# Altium schematic sheet SE_Diff.SchDoc
size A; SheetNumber: 13; SheetTotal: 14
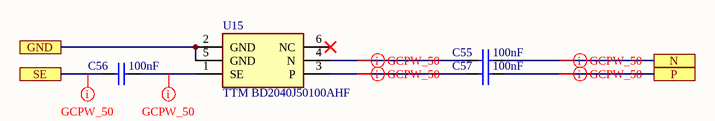
[diagram p0: SE_Diff.SchDoc]

## Parts
C55  100nF  [SMD-0402]
C56  100nF  [SMD-0402]
C57  100nF  [SMD-0402]
U15  TTM BD2040J50100AHF  [Anaren Balun BD2040J50100AHF]

## Ports
GND, N, P, SE

## Nets
GND: U15.2(GND) U15.5(GND) ; port GND
N: C55.1 ; port N
P: C57.1 ; port P
SE: C56.2 ; port SE
NetC55_2: C55.2 U15.4(N)
NetC56_1: C56.1 U15.1(SE)
NetC57_2: C57.2 U15.3(P)

Not connected (* = marked no-connect by the designer): U15 6(NC)*

## Layout directives
net class GCPW_50: N, NetC55_2, NetC56_1, NetC57_2, P, SE

## Library data of the parts
C55-C57 = CAP0402: Ceramic Capacitor 0402
U15 = Anaren Balun - BD2040J50100AHF: Filter; Manufacturer_Name: ANAREN; Datasheet Link: https://cdn.anaren.com/product-documents/Xinger/BalunTransformers/BD2040J50100AHF/BD2040J50100AHF_DataSheet(Rev_C).pdf; Height: 0.78mm; Manufacturer_Part_Number: BD2040J50100AHF; Mouser Part Number: 620-BD2040J50100AH; Mouser Price/Stock: https://www.mouser.co.uk/ProductDetail/Anaren/BD2040J50100AHF?qs=BDRISUKNLIfZZVKLkyHFlw%3D%3D